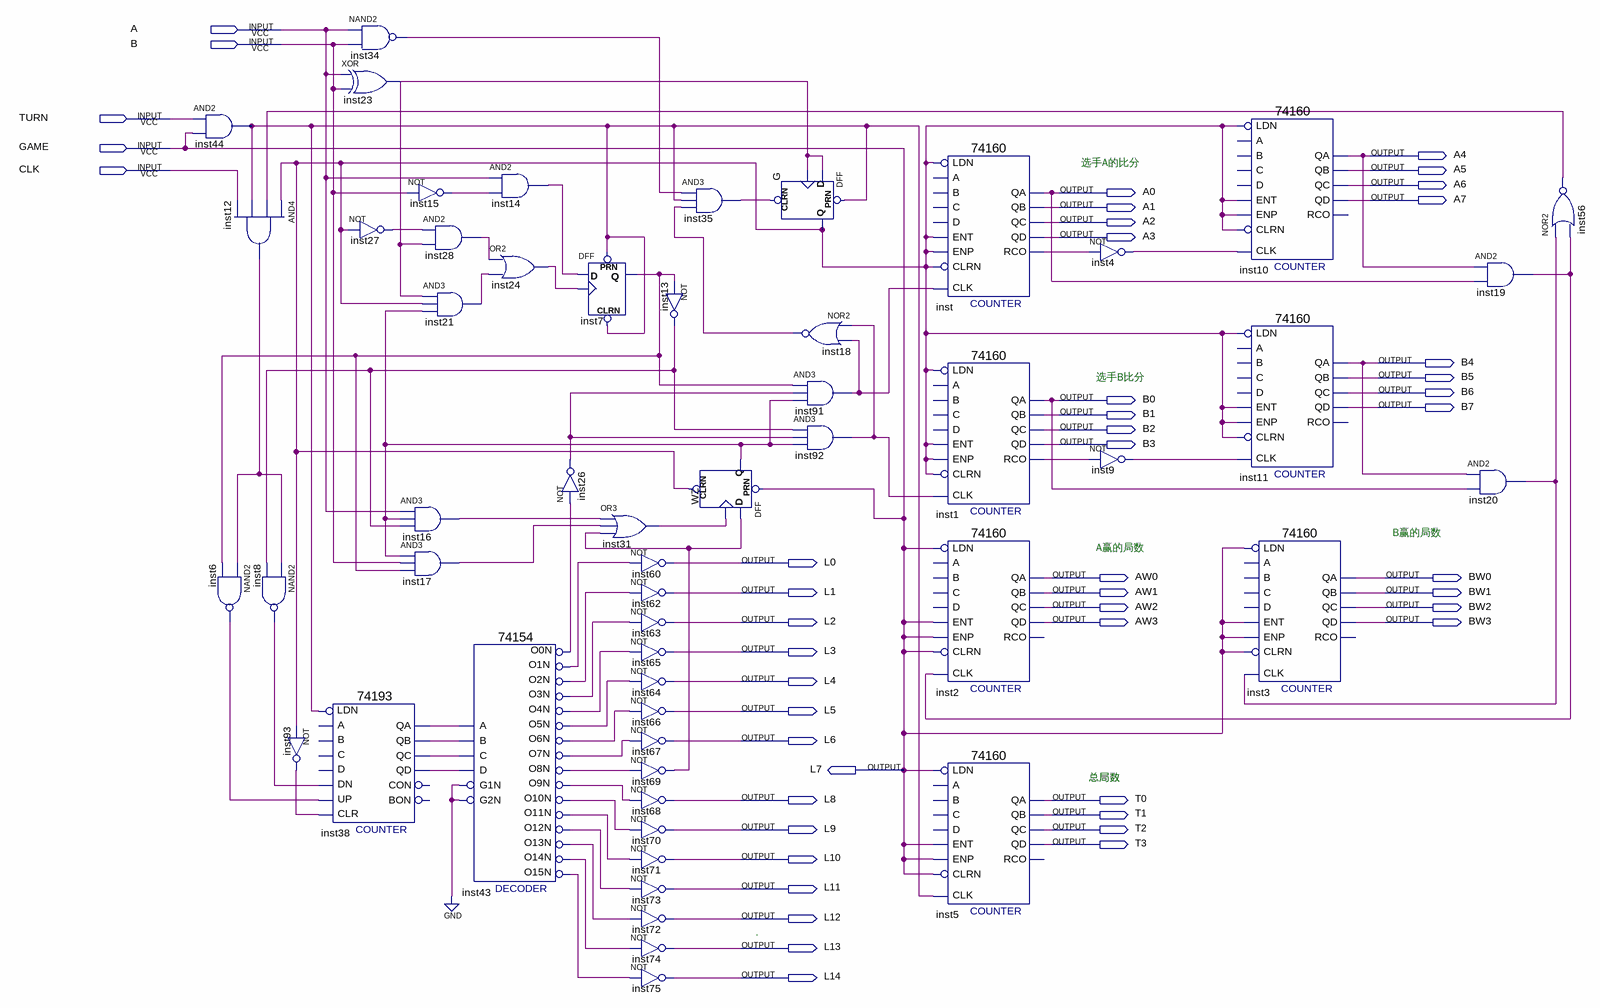
[diagram p0: schematic sheet]
// Quartus schematic PingPongGame.bdf as structural Verilog: 54 symbols, 48 pins
module PingPongGame (
  input  A,
  input  B,
  input  TURN,
  input  GAME,
  input  CLK,
  output A4,
  output A5,
  output A6,
  output A0,
  output A7,
  output A1,
  output A2,
  output A3,
  output B4,
  output B5,
  output B6,
  output B0,
  output B7,
  output B1,
  output B2,
  output B3,
  output L0,
  output AW0,
  output BW0,
  output L1,
  output AW1,
  output BW1,
  output AW2,
  output BW2,
  output L2,
  output AW3,
  output BW3,
  output L3,
  output L4,
  output L5,
  output L6,
  output L7,
  output L8,
  output T0,
  output T1,
  output L9,
  output T2,
  output T3,
  output L10,
  output L11,
  output L12,
  output L13,
  output L14
);

  wire G_q, inst1_rco, inst4_out, inst6_out, inst7_q, inst8_out, inst9_out, inst12_out, inst13_out,
       inst14_out, inst15_out, inst16_out, inst17_out, inst18_out, inst19_out, inst20_out, inst21_out,
       inst23_out, inst24_out, inst26_out, inst27_out, inst28_out, inst31_out, inst34_out, inst35_out,
       inst38_qa, inst38_qb, inst38_qc, inst38_qd, inst43_o0n, inst43_o1n, inst43_o2n, inst43_o3n,
       inst43_o4n, inst43_o5n, inst43_o6n, inst43_o7n, inst43_o8n, inst43_o9n, inst43_o10n, inst43_o11n,
       inst43_o12n, inst43_o13n, inst43_o14n, inst43_o15n, inst44_out, inst56_out, inst69_out, inst91_out,
       inst92_out, inst93_out, inst_rco, WZ_q;

  and inst44 (inst44_out, TURN, GAME);
  nand inst6 (inst6_out, inst12_out, inst7_q);
  and inst12 (inst12_out, G_q, inst56_out, inst44_out, CLK);
  nand inst8 (inst8_out, inst12_out, inst13_out);
  \74193  inst38 (
    .CLR(inst93_out), .UP(inst6_out), .DN(inst8_out), .LDN(inst44_out), .QB(inst38_qb), .QA(inst38_qa),
    .QD(inst38_qd), .QC(inst38_qc));  // open: D, C, B, A, CON, BON
  not inst93 (inst93_out, G_q);
  nand inst34 (inst34_out, A, B);
  xor inst23 (inst23_out, A, B);
  not inst27 (inst27_out, G_q);
  not inst15 (inst15_out, B);
  and inst28 (inst28_out, inst27_out, inst23_out);
  and inst21 (inst21_out, inst23_out, G_q, WZ_q);
  and inst16 (inst16_out, A, WZ_q, inst13_out);
  and inst17 (inst17_out, WZ_q, B, inst7_q);
  and inst14 (inst14_out, A, inst15_out);
  or inst24 (inst24_out, inst28_out, inst21_out);
  \74154  inst43 (
    .C(inst38_qc), .D(inst38_qd), .B(inst38_qb), .A(inst38_qa), .G1N(1'b0), .G2N(1'b0), .O0N(inst43_o0n),
    .O12N(inst43_o12n), .O15N(inst43_o15n), .O10N(inst43_o10n), .O11N(inst43_o11n), .O1N(inst43_o1n),
    .O13N(inst43_o13n), .O14N(inst43_o14n), .O4N(inst43_o4n), .O3N(inst43_o3n), .O2N(inst43_o2n),
    .O7N(inst43_o7n), .O6N(inst43_o6n), .O5N(inst43_o5n), .O9N(inst43_o9n), .O8N(inst43_o8n));
  not inst26 (inst26_out, inst43_o0n);
  DFF inst7 (.CLRN(inst44_out), .CLK(inst24_out), .D(inst14_out), .PRN(inst44_out), .Q(inst7_q));
  or inst31 (inst31_out, inst16_out, inst17_out, inst69_out);
  not inst60 (L0, inst43_o1n);
  not inst62 (L1, inst43_o2n);
  not inst63 (L2, inst43_o3n);
  not inst65 (L3, inst43_o4n);
  not inst64 (L4, inst43_o5n);
  not inst66 (L5, inst43_o6n);
  not inst67 (L6, inst43_o7n);
  not inst69 (inst69_out, inst43_o8n);
  not inst68 (L8, inst43_o9n);
  not inst70 (L9, inst43_o10n);
  not inst71 (L10, inst43_o11n);
  not inst73 (L11, inst43_o12n);
  not inst72 (L12, inst43_o13n);
  not inst74 (L13, inst43_o14n);
  not inst75 (L14, inst43_o15n);
  and inst35 (inst35_out, inst34_out, inst44_out, inst18_out);
  not inst13 (inst13_out, inst7_q);
  DFF WZ (.CLRN(G_q), .CLK(inst31_out), .D(inst69_out), .PRN(GAME), .Q(WZ_q));
  DFF G (.CLRN(inst35_out), .CLK(inst23_out), .D(inst23_out), .PRN(inst44_out), .Q(G_q));
  nor inst18 (inst18_out, inst92_out, inst91_out);
  and inst91 (inst91_out, inst7_q, inst26_out, WZ_q);
  and inst92 (inst92_out, inst13_out, inst26_out, WZ_q);
  \74160  inst (
    .CLK(inst91_out), .ENT(G_q), .LDN(G_q), .ENP(G_q), .CLRN(G_q), .QD(A3), .QA(A0), .QB(A1), .QC(A2),
    .RCO(inst_rco));  // open: A, B, C, D
  \74160  inst1 (
    .CLK(inst92_out), .ENT(G_q), .LDN(G_q), .ENP(G_q), .CLRN(G_q), .QD(B3), .QA(B0), .QB(B1), .QC(B2),
    .RCO(inst1_rco));  // open: A, B, C, D
  \74160  inst2 (
    .CLK(inst19_out), .ENT(GAME), .LDN(GAME), .ENP(GAME), .CLRN(GAME), .QD(AW3), .QA(AW0), .QB(AW1), .QC(AW2));  // open: A, B, C, D, RCO
  \74160  inst5 (
    .CLK(inst44_out), .ENT(GAME), .LDN(GAME), .ENP(GAME), .CLRN(GAME), .QD(T3), .QA(T0), .QB(T1), .QC(T2));  // open: A, B, C, D, RCO
  not inst4 (inst4_out, inst_rco);
  not inst9 (inst9_out, inst1_rco);
  \74160  inst10 (
    .CLK(inst4_out), .ENT(G_q), .LDN(G_q), .ENP(G_q), .CLRN(G_q), .QD(A7), .QA(A4), .QB(A5), .QC(A6));  // open: A, B, C, D, RCO
  \74160  inst11 (
    .CLK(inst9_out), .ENT(G_q), .LDN(G_q), .ENP(G_q), .CLRN(G_q), .QD(B7), .QA(B4), .QB(B5), .QC(B6));  // open: A, B, C, D, RCO
  \74160  inst3 (
    .CLK(inst20_out), .ENT(GAME), .LDN(GAME), .ENP(GAME), .CLRN(GAME), .QD(BW3), .QA(BW0), .QB(BW1), .QC(BW2));  // open: A, B, C, D, RCO
  and inst19 (inst19_out, A4, A0);
  and inst20 (inst20_out, B4, B0);
  nor inst56 (inst56_out, inst20_out, inst19_out);

  assign L7 = GAME;

  // Notes on the sheet:
  //   选手A的比分
  //   选手B比分
  //   B赢的局数
  //   A赢的局数
  //   总局数
  //   .
endmodule
